# Altium schematic sheet sch_sunstrate_board_RS485.SchDoc
size A4; SheetNumber: 5; SheetTotal: 6
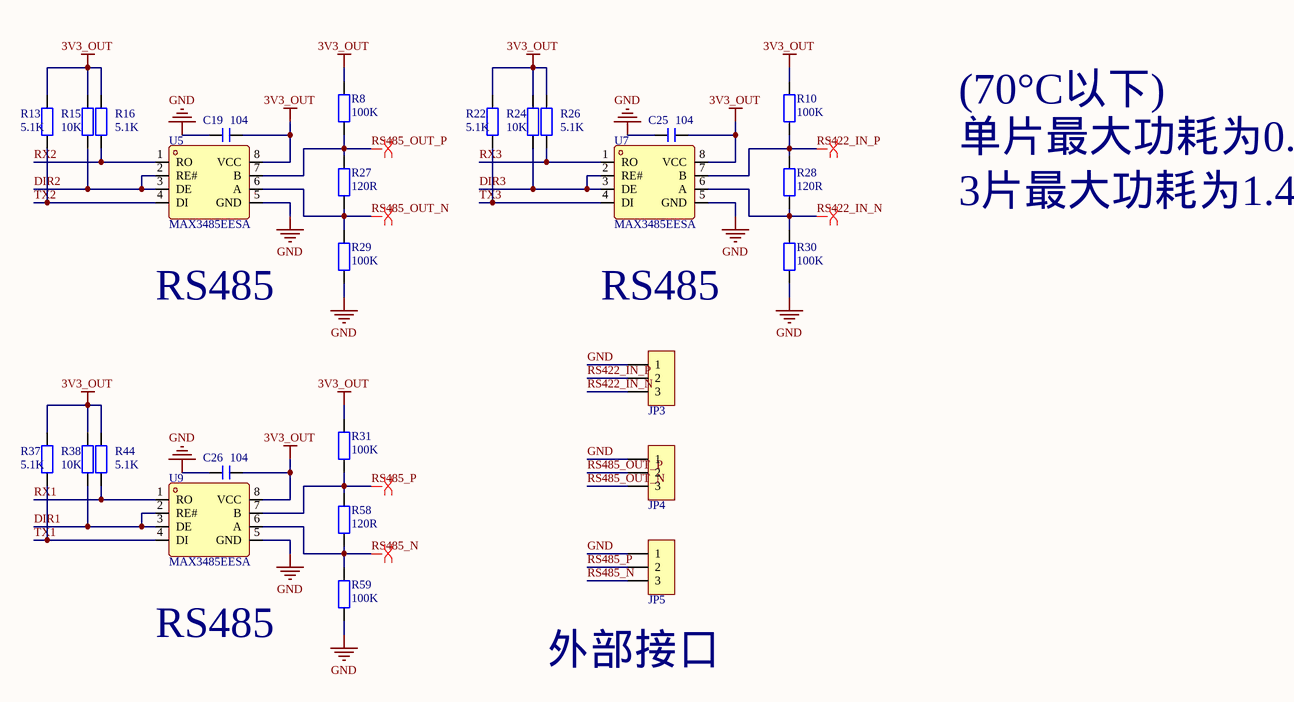
[diagram p0: sch_sunstrate_board_RS485.SchDoc]

## Parts
C19  104  [C 0805_L]
C25  104  [C 0805_L]
C26  104  [C 0805_L]
JP3  HDR-1X3  [KF128-3.81-3P]  (value not drawn)
JP4  HDR-1X3  [KF128-3.81-3P]  (value not drawn)
JP5  HDR-1X3  [KF128-3.81-3P]  (value not drawn)
R8  100K  [R 0805_L]
R10  100K  [R 0805_L]
R13  5.1K  [R 0805_L]
R15  10K  [R 0805_L]
R16  5.1K  [R 0805_L]
R22  5.1K  [R 0805_L]
R24  10K  [R 0805_L]
R26  5.1K  [R 0805_L]
R27  120R  [R 0603_L]
R28  120R  [R 0603_L]
R29  100K  [R 0805_L]
R30  100K  [R 0805_L]
R31  100K  [R 0805_L]
R37  5.1K  [R 0805_L]
R38  10K  [R 0805_L]
R44  5.1K  [R 0805_L]
R58  120R  [R 0603_L]
R59  100K  [R 0805_L]
U5  MAX3485EESA  [MAX3485EESA]
U7  MAX3485EESA  [MAX3485EESA]
U9  MAX3485EESA  [MAX3485EESA]

## Nets
3V3_OUT: C19.1 C25.1 C26.1 R8.1 R10.1 R13.2 R15.2 R16.2 R22.2 R24.2 R26.2 R31.1 R37.2 R38.2 R44.2 U5.8(VCC) U7.8(VCC) U9.8(VCC)
GND: C19.2 C25.2 C26.2 JP3.1 JP4.1 JP5.1 R29.2 R30.2 R59.2 U5.5(GND) U7.5(GND) U9.5(GND)
DIR1: R38.1 U9.2(RE#) U9.3(DE)
DIR2: R15.1 U5.2(RE#) U5.3(DE)
DIR3: R24.1 U7.2(RE#) U7.3(DE)
RS422_IN_N: JP3.3 R28.2 R30.1 U7.6(A)
RS422_IN_P: JP3.2 R10.2 R28.1 U7.7(B)
RS485_N: JP5.3 R58.2 R59.1 U9.6(A)
RS485_OUT_N: JP4.3 R27.2 R29.1 U5.6(A)
RS485_OUT_P: JP4.2 R8.2 R27.1 U5.7(B)
RS485_P: JP5.2 R31.2 R58.1 U9.7(B)
RX1: R44.1 U9.1(RO)
RX2: R16.1 U5.1(RO)
RX3: R26.1 U7.1(RO)
TX1: R37.1 U9.4(DI)
TX2: R13.1 U5.4(DI)
TX3: R22.1 U7.4(DI)

## Layout directives
differential pair: RS422_IN_N, RS422_IN_P, RS485_N, RS485_OUT_N, RS485_OUT_P, RS485_P

## Notes on the sheet
- (70°C以下)
- 单片最大功耗为0.471W
- 3片最大功耗为1.413W
- RS485
- (near JP5) 外部接口

## Library data of the parts
C19 C25 C26 = C: 贴片电容; BOM名称: 无极性贴片电容; 淘宝ID: 封装库来自淘宝 ID：黄晶宝石; 联系售后，技术支持: https://shop463601444.taobao.com; 唯一出售店铺网址: https://shop463601444.taobao.com
JP3-JP5 = Header 3: 3P接插件; 版权归属: 封装库来自淘宝 ID：黄晶宝石; BOM名称: 3P接插件; 学习资源: https://shop463601444.taobao.com
R8 R10 R13 R15 R16 R22 R24 R26-R31 R37 R38 R44 R58 R59 = R: 贴片电阻; 版权归属: 来自淘宝 ID：黄晶宝石; 封装库来自淘宝卖家 ID：黄晶宝石: 其他店铺购入均为盗版，不享受售后技术支持服务，请立即申请退款; BOM名称: 贴片电阻; 联系售后: https://item.taobao.com/item.htm?id=566775463719
U5 U7 U9 = MAX3485EESA: IC